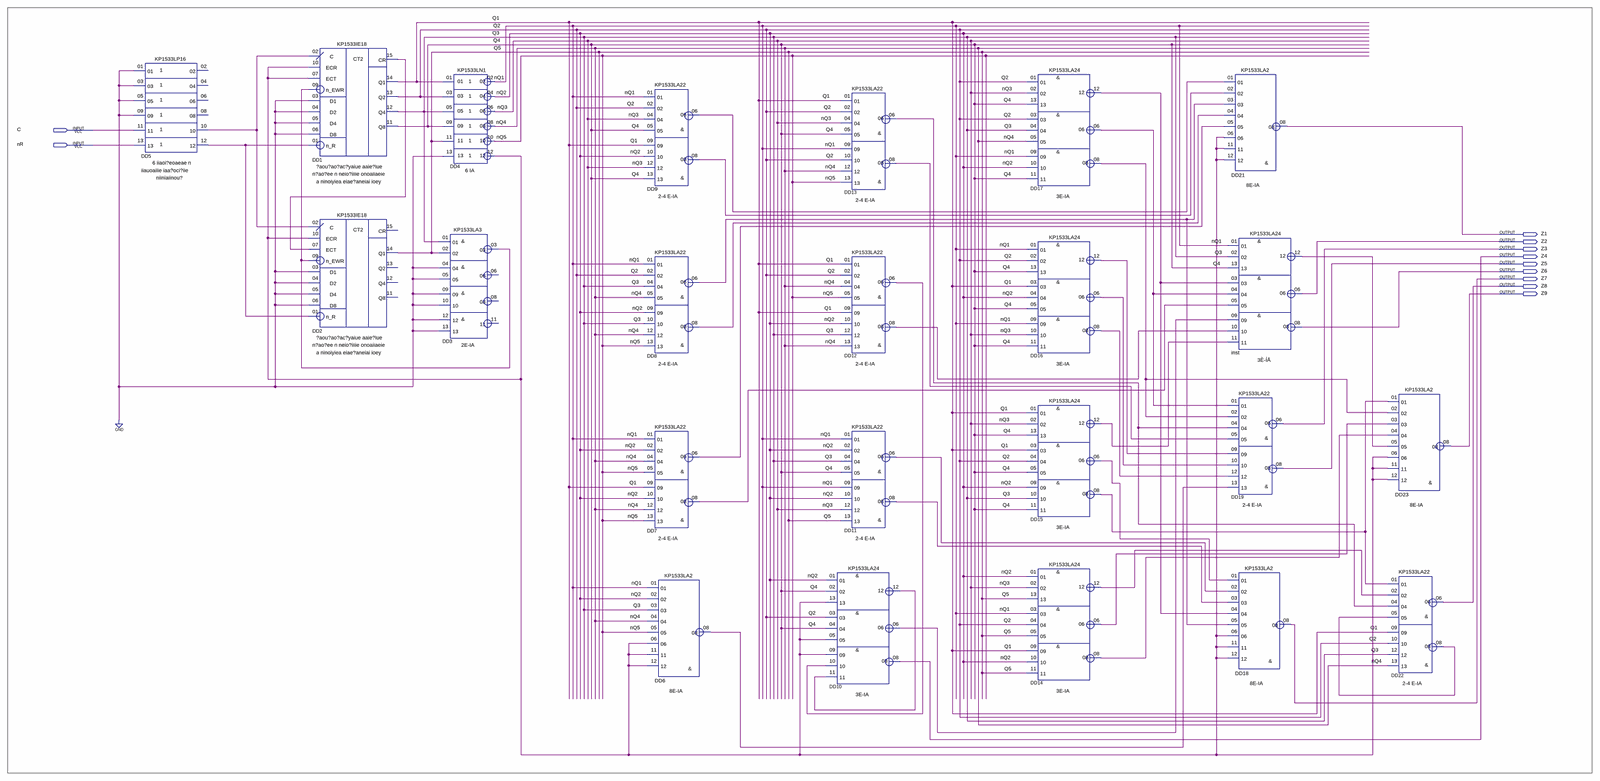
[diagram p0: schematic sheet, whole]
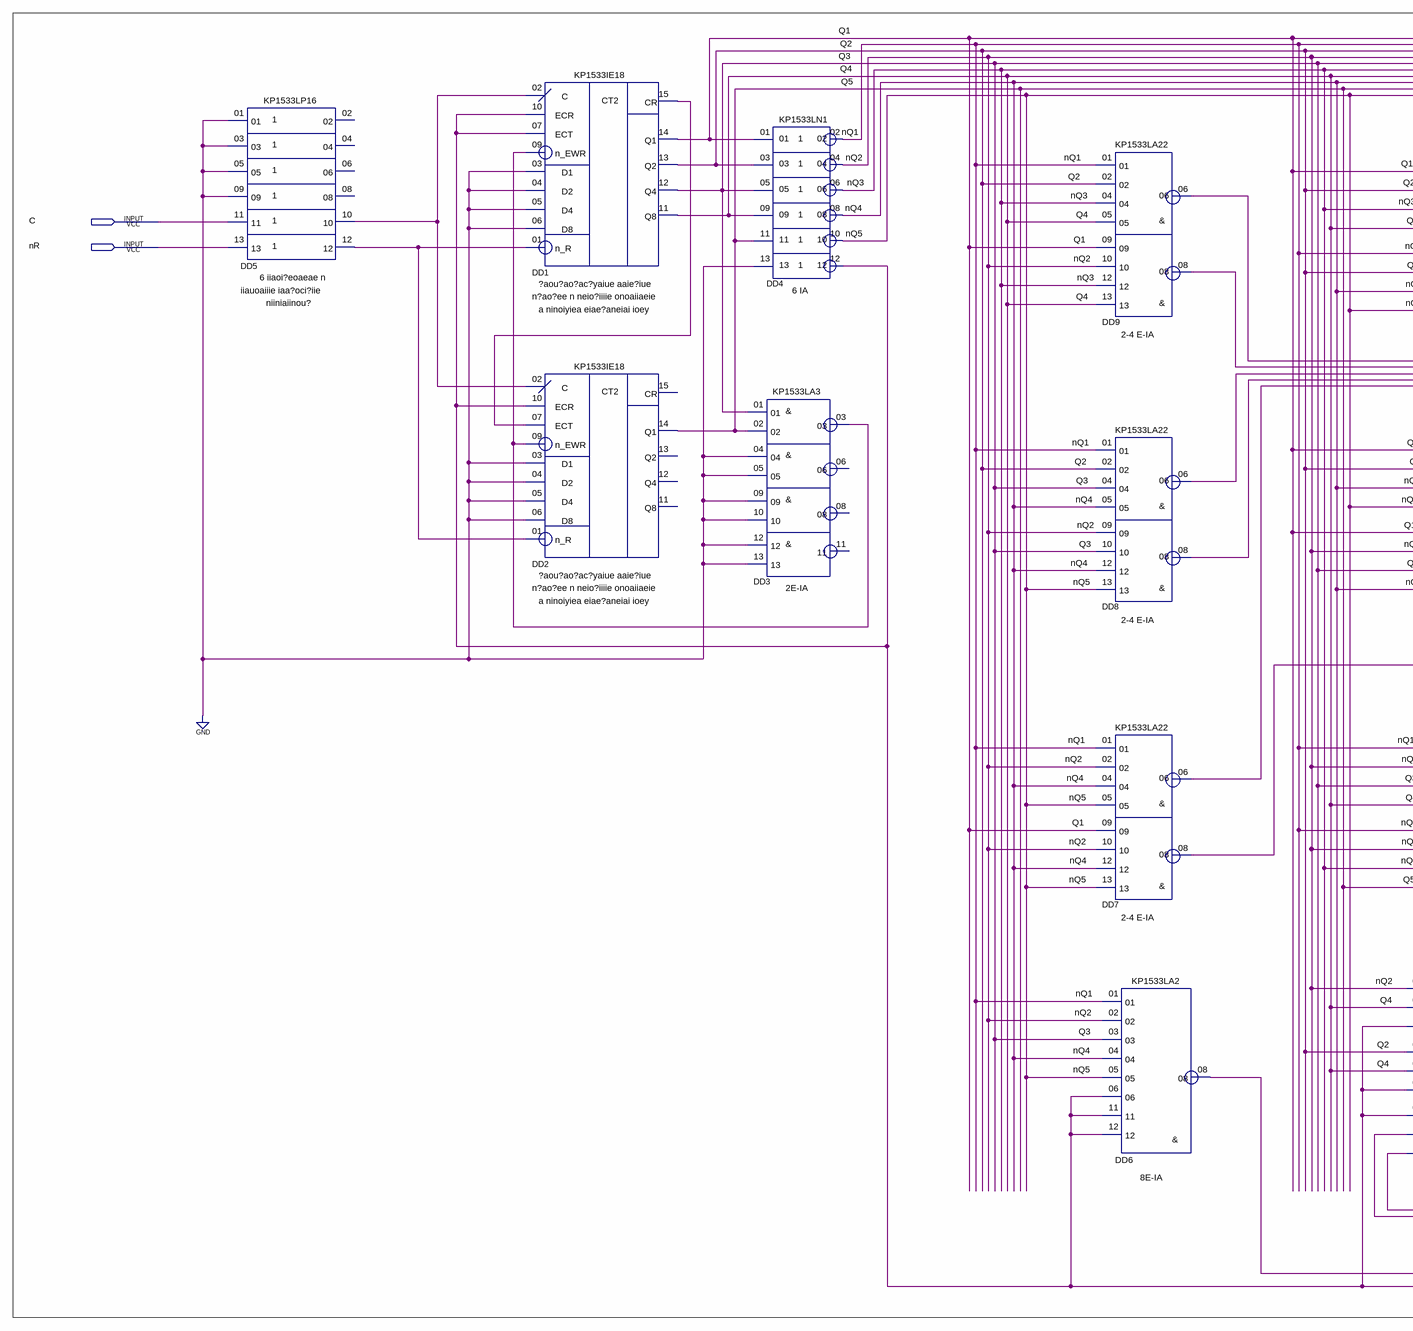
[diagram p1: schematic sheet, left part]
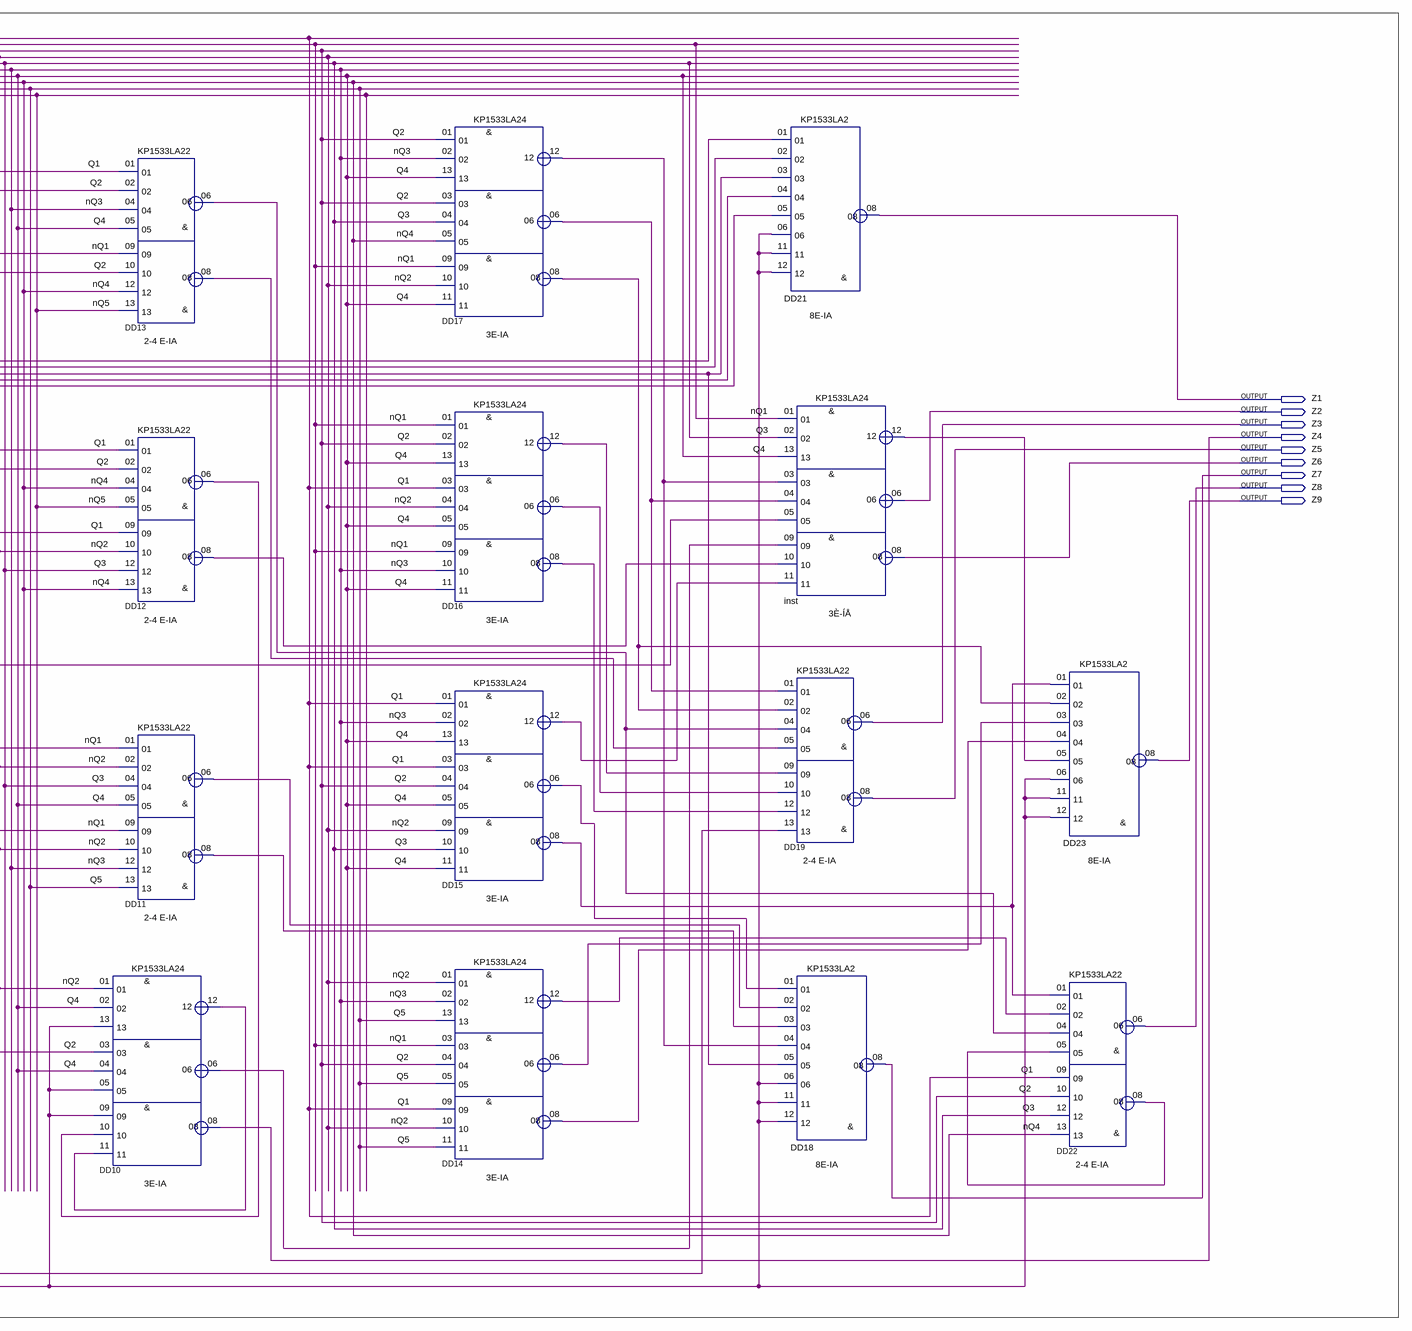
[diagram p2: schematic sheet, right part]
// Quartus schematic IE_NAND_GN.bdf as structural Verilog: 23 symbols, 11 pins
module IE_NAND_GN (
  input  C,
  input  nR,
  output Z1,
  output Z2,
  output Z3,
  output Z4,
  output Z5,
  output Z6,
  output Z7,
  output Z8,
  output Z9
);

  wire DD1_cr, DD3_03, DD4_12, DD5_10, DD5_12, DD6_08, DD7_06, DD7_08, DD8_06, DD8_08, DD9_06, DD9_08,
       DD10_06, DD10_12, DD11_06, DD11_08, DD12_06, DD12_08, DD13_06, DD13_08, DD14_06, DD14_08, DD14_12,
       DD15_06, DD15_08, DD15_12, DD16_06, DD16_08, DD16_12, DD17_06, DD17_08, DD17_12, DD22_08, inst_12,
       nQ1, nQ2, nQ3, nQ4, nQ5, Q1, Q2, Q3, Q4, Q5;

  KP1533LP16 DD5 (
    .\01 (1'b0), .\03 (1'b0), .\05 (1'b0), .\09 (1'b0), .\11 (C), .\13 (nR), .\10 (DD5_10), .\12 (DD5_12));  // open: 02, 04, 06, 08
  KP1533IE18 DD1 (
    .n_EWR(DD3_03), .D1(1'b0), .D2(1'b0), .D4(1'b0), .D8(1'b0), .ECT(DD4_12), .ECR(DD4_12), .n_R(DD5_12),
    .C(DD5_10), .Q1(Q1), .Q2(Q2), .Q4(Q3), .Q8(Q4), .CR(DD1_cr));
  KP1533IE18 DD2 (
    .n_EWR(DD3_03), .D1(1'b0), .D2(1'b0), .D4(1'b0), .D8(1'b0), .ECT(DD1_cr), .ECR(DD4_12), .n_R(DD5_12),
    .C(DD5_10), .Q1(Q5));  // open: Q2, Q4, Q8, CR
  KP1533LN1 DD4 (
    .\01 (Q1), .\03 (Q2), .\05 (Q3), .\09 (Q4), .\11 (Q5), .\13 (1'b0), .\02 (nQ1), .\04 (nQ2), .\06 (nQ3),
    .\08 (nQ4), .\10 (nQ5), .\12 (DD4_12));
  KP1533LA3 DD3 (
    .\01 (Q3), .\02 (Q5), .\04 (1'b0), .\05 (1'b0), .\09 (1'b0), .\10 (1'b0), .\12 (1'b0), .\13 (1'b0),
    .\03 (DD3_03));  // open: 06, 08, 11
  KP1533LA22 DD9 (
    .\01 (nQ1), .\02 (Q2), .\04 (nQ3), .\05 (Q4), .\09 (Q1), .\10 (nQ2), .\12 (nQ3), .\13 (Q4),
    .\06 (DD9_06), .\08 (DD9_08));
  KP1533LA22 DD8 (
    .\01 (nQ1), .\02 (Q2), .\04 (Q3), .\05 (nQ4), .\09 (nQ2), .\10 (Q3), .\12 (nQ4), .\13 (nQ5),
    .\06 (DD8_06), .\08 (DD8_08));
  KP1533LA22 DD7 (
    .\01 (nQ1), .\02 (nQ2), .\04 (nQ4), .\05 (nQ5), .\09 (Q1), .\10 (nQ2), .\12 (nQ4), .\13 (nQ5),
    .\06 (DD7_06), .\08 (DD7_08));
  KP1533LA2 DD6 (
    .\01 (nQ1), .\02 (nQ2), .\03 (Q3), .\04 (nQ4), .\05 (nQ5), .\06 (DD4_12), .\11 (DD4_12), .\12 (DD4_12),
    .\08 (DD6_08));
  KP1533LA24 DD10 (
    .\01 (nQ2), .\02 (Q4), .\13 (DD4_12), .\03 (Q2), .\04 (Q4), .\05 (DD4_12), .\09 (DD4_12), .\10 (DD12_06),
    .\11 (DD10_12), .\12 (DD10_12), .\06 (DD10_06), .\08 (Z4));
  KP1533LA22 DD13 (
    .\01 (Q1), .\02 (Q2), .\04 (nQ3), .\05 (Q4), .\09 (nQ1), .\10 (Q2), .\12 (nQ4), .\13 (nQ5),
    .\06 (DD13_06), .\08 (DD13_08));
  KP1533LA22 DD12 (
    .\01 (Q1), .\02 (Q2), .\04 (nQ4), .\05 (nQ5), .\09 (Q1), .\10 (nQ2), .\12 (Q3), .\13 (nQ4),
    .\06 (DD12_06), .\08 (DD12_08));
  KP1533LA22 DD11 (
    .\01 (nQ1), .\02 (nQ2), .\04 (Q3), .\05 (Q4), .\09 (nQ1), .\10 (nQ2), .\12 (nQ3), .\13 (Q5),
    .\06 (DD11_06), .\08 (DD11_08));
  KP1533LA24 DD17 (
    .\01 (Q2), .\02 (nQ3), .\13 (Q4), .\03 (Q2), .\04 (Q3), .\05 (nQ4), .\09 (nQ1), .\10 (nQ2), .\11 (Q4),
    .\12 (DD17_12), .\06 (DD17_06), .\08 (DD17_08));
  KP1533LA24 DD16 (
    .\01 (nQ1), .\02 (Q2), .\13 (Q4), .\03 (Q1), .\04 (nQ2), .\05 (Q4), .\09 (nQ1), .\10 (nQ3), .\11 (Q4),
    .\12 (DD16_12), .\06 (DD16_06), .\08 (DD16_08));
  KP1533LA24 DD15 (
    .\01 (Q1), .\02 (nQ3), .\13 (Q4), .\03 (Q1), .\04 (Q2), .\05 (Q4), .\09 (nQ2), .\10 (Q3), .\11 (Q4),
    .\12 (DD15_12), .\06 (DD15_06), .\08 (DD15_08));
  KP1533LA24 DD14 (
    .\01 (nQ2), .\02 (nQ3), .\13 (Q5), .\03 (nQ1), .\04 (Q2), .\05 (Q5), .\09 (Q1), .\10 (nQ2), .\11 (Q5),
    .\12 (DD14_12), .\06 (DD14_06), .\08 (DD14_08));
  KP1533LA2 DD21 (
    .\01 (DD9_06), .\02 (DD9_08), .\03 (DD8_06), .\04 (DD8_08), .\05 (DD7_06), .\06 (DD4_12), .\11 (DD4_12),
    .\12 (DD4_12), .\08 (Z1));
  KP1533LA24 inst (
    .\01 (nQ1), .\02 (Q3), .\13 (Q4), .\03 (DD17_12), .\04 (DD17_06), .\05 (DD7_08), .\09 (DD10_06),
    .\10 (DD12_08), .\11 (DD15_12), .\12 (inst_12), .\06 (Z2), .\08 (Z6));
  KP1533LA22 DD19 (
    .\01 (DD17_06), .\02 (DD17_08), .\04 (DD13_06), .\05 (DD13_08), .\09 (DD16_12), .\10 (DD16_06),
    .\12 (DD16_08), .\13 (DD6_08), .\06 (Z3), .\08 (Z5));
  KP1533LA2 DD18 (
    .\01 (DD15_06), .\02 (DD11_06), .\03 (DD11_08), .\04 (DD17_12), .\05 (DD8_06), .\06 (DD4_12),
    .\11 (DD4_12), .\12 (DD4_12), .\08 (Z7));
  KP1533LA2 DD23 (
    .\01 (DD15_08), .\02 (DD17_08), .\03 (DD14_06), .\04 (DD14_08), .\05 (inst_12), .\06 (DD4_12),
    .\11 (DD4_12), .\12 (DD4_12), .\08 (Z9));
  KP1533LA22 DD22 (
    .\01 (DD15_08), .\02 (DD14_12), .\04 (DD13_06), .\05 (DD22_08), .\09 (Q1), .\10 (Q2), .\12 (Q3),
    .\13 (nQ4), .\06 (Z8), .\08 (DD22_08));
endmodule
